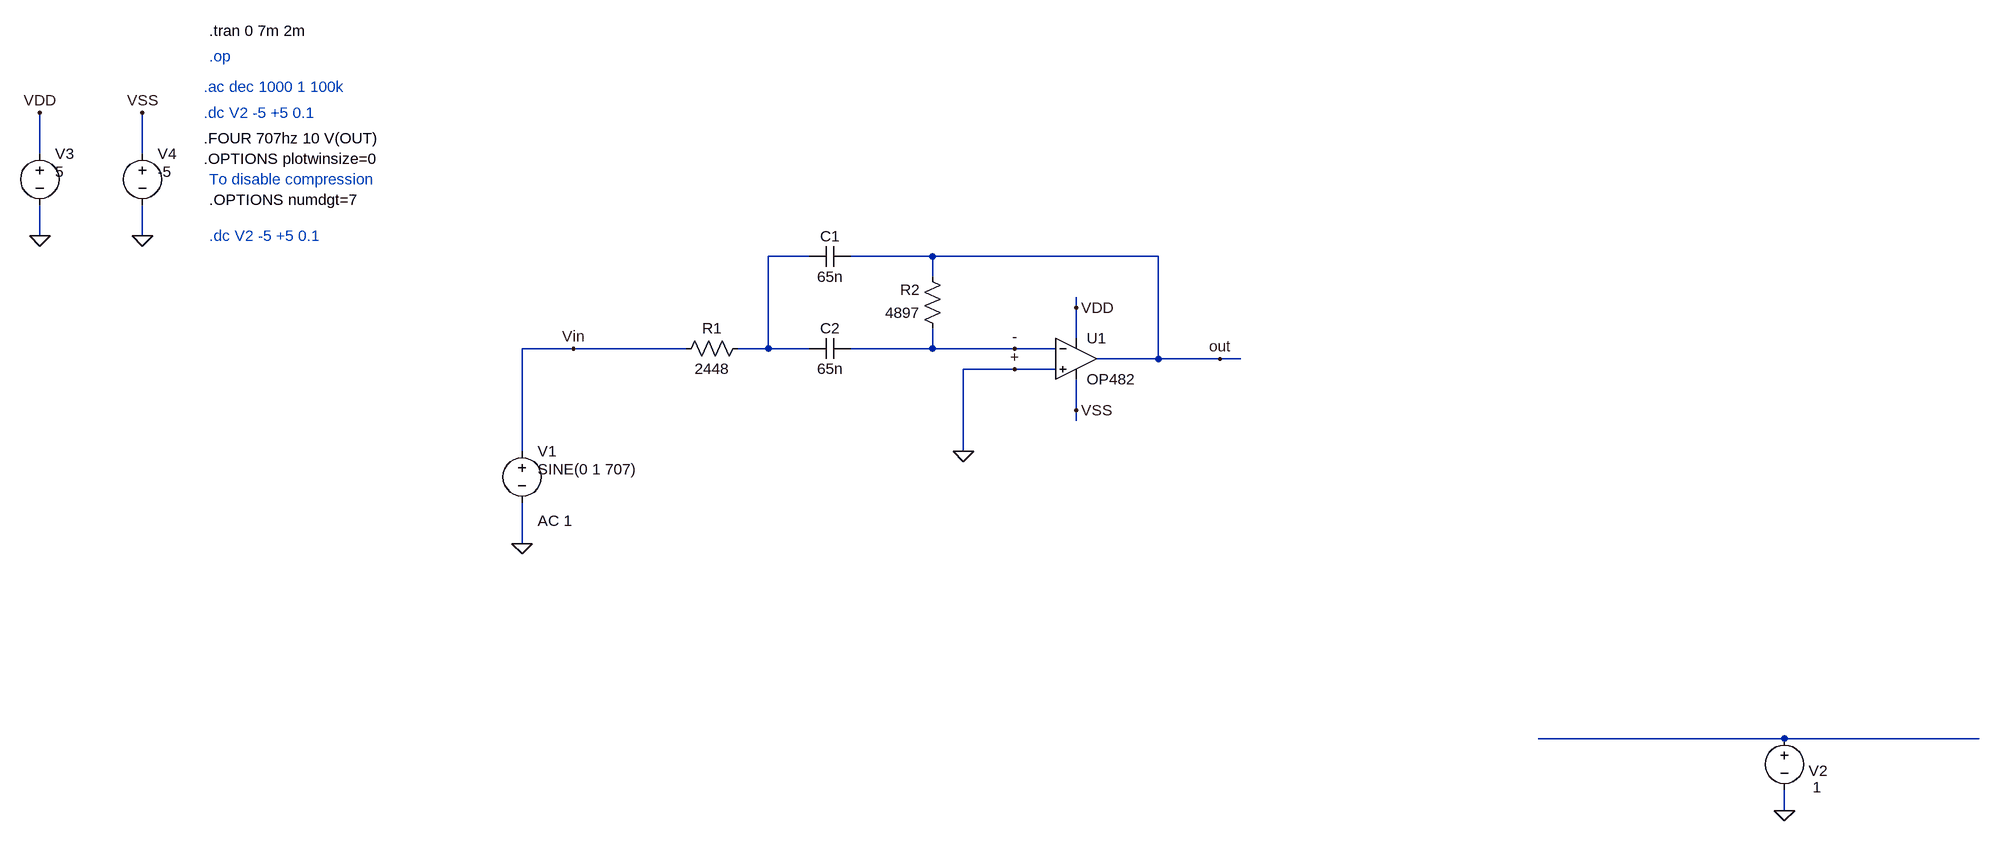
[diagram p0: schematic FTB_Rauch.asc]
FTB_Rauch.asc, the LTspice schematic file:
Version 4
SHEET 1 3876 1708
WIRE 752 -144 752 -208
WIRE 912 -144 912 -208
WIRE 752 -16 752 -64
WIRE 912 -16 912 -64
WIRE 1952 16 1888 16
WIRE 2144 16 2016 16
WIRE 2496 16 2144 16
WIRE 2144 48 2144 16
WIRE 2368 96 2368 80
WIRE 2368 144 2368 96
WIRE 1584 160 1504 160
WIRE 1760 160 1584 160
WIRE 1888 160 1888 16
WIRE 1888 160 1840 160
WIRE 1952 160 1888 160
WIRE 2144 160 2144 128
WIRE 2144 160 2016 160
WIRE 2272 160 2144 160
WIRE 2336 160 2272 160
WIRE 2496 176 2496 16
WIRE 2496 176 2400 176
WIRE 2592 176 2496 176
WIRE 2624 176 2592 176
WIRE 2272 192 2192 192
WIRE 2336 192 2272 192
WIRE 2368 256 2368 208
WIRE 2368 272 2368 256
WIRE 1504 320 1504 160
WIRE 2192 320 2192 192
WIRE 1504 464 1504 400
WIRE 3472 768 3088 768
WIRE 3776 768 3472 768
WIRE 3472 880 3472 848
FLAG 752 -16 0
FLAG 912 -16 0
FLAG 752 -208 VDD
FLAG 912 -208 VSS
FLAG 2592 176 out
FLAG 2368 256 VSS
FLAG 2368 96 VDD
FLAG 1584 160 Vin
FLAG 2272 160 -
FLAG 1504 464 0
FLAG 3472 880 0
FLAG 2192 320 0
FLAG 2272 192 +
SYMBOL voltage 752 -160 R0
WINDOW 123 24 124 Left 2
WINDOW 39 0 0 Left 2
WINDOW 3 24 44 Left 2
SYMATTR Value 5
SYMATTR InstName V3
SYMBOL voltage 912 -160 R0
WINDOW 123 24 124 Left 2
WINDOW 39 0 0 Left 2
WINDOW 3 24 44 Left 2
SYMATTR Value -5
SYMATTR InstName V4
SYMBOL voltage 1504 304 R0
WINDOW 123 24 124 Left 2
WINDOW 39 0 0 Left 2
WINDOW 3 24 44 Left 2
SYMATTR Value2 AC 1
SYMATTR Value SINE(0 1 707)
SYMATTR InstName V1
SYMBOL cap 2016 32 M270
WINDOW 0 32 32 VTop 2
WINDOW 3 0 32 VBottom 2
SYMATTR InstName C1
SYMATTR Value 65n
SYMBOL res 1856 144 R90
WINDOW 0 0 56 VBottom 2
WINDOW 3 32 56 VTop 2
SYMATTR InstName R1
SYMATTR Value 2448
SYMBOL res 2160 144 R180
WINDOW 0 36 76 Left 2
WINDOW 3 36 40 Left 2
SYMATTR InstName R2
SYMATTR Value 4897
SYMBOL cap 1952 176 R270
WINDOW 0 32 32 VTop 2
WINDOW 3 0 32 VBottom 2
SYMATTR InstName C2
SYMATTR Value 65n
SYMBOL voltage 3472 752 R0
WINDOW 0 38 66 Left 2
WINDOW 3 44 92 Left 2
WINDOW 123 0 0 Left 0
WINDOW 39 0 0 Left 0
SYMATTR InstName V2
SYMATTR Value 1
SYMBOL OpAmps\\OP482 2368 112 R0
SYMATTR InstName U1
TEXT 1008 -248 Left 2 ;.ac dec 1000 1 100k
TEXT 1016 -296 Left 2 ;.op
TEXT 1008 -208 Left 2 ;.dc V2 -5 +5 0.1
TEXT 1008 -168 Left 2 !.FOUR 707hz 10 V(OUT)
TEXT 1008 -136 Left 2 !.OPTIONS plotwinsize=0
TEXT 1016 -104 Left 2 ;To disable compression
TEXT 1016 -72 Left 2 !.OPTIONS numdgt=7
TEXT 1016 -16 Left 2 ;.dc V2 -5 +5 0.1
TEXT 1016 -336 Left 2 !.tran 0 7m 2m

The netlist it stands for:
* FTB_Rauch.asc
V3 VDD 0 5
V4 VSS 0 -5
V1 Vin 0 SINE(0 1 707) AC 1
C1 out N001 65n
R1 N001 Vin 2448
R2 - out 4897
C2 N001 - 65n
V2 N002 0 1
XU1 0 - VDD VSS out OP482  ; pins In+ In- V+ V- OUT
* .ac dec 1000 1 100k
* .op
* .dc V2 -5 +5 0.1
.FOUR 707hz 10 V(OUT)
.OPTIONS plotwinsize=0
* To disable compression
.OPTIONS numdgt=7
* .dc V2 -5 +5 0.1
.tran 0 7m 2m
.backanno
.end